# Altium project Buck-Converter-MP2315.PrjPcb
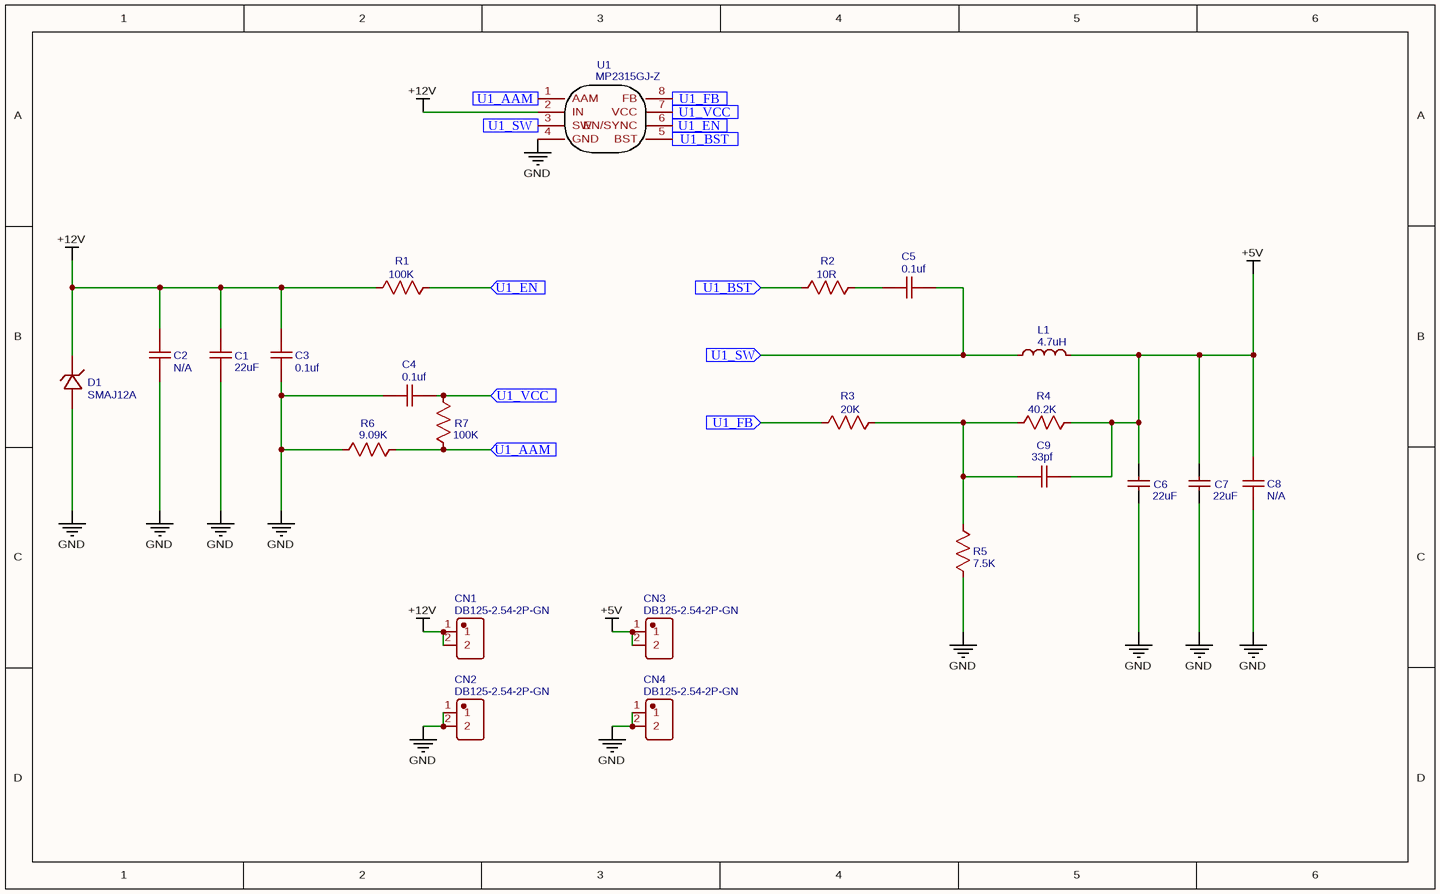
[diagram p0: Buck-Converter-MP2315.schdoc]
1 sheet, 23 parts. Net scope: flat (ports and power ports of the same name join across sheets).
Board file: Buck-Converter-MP2315.pcbdoc

## Sheet Buck-Converter-MP2315.schdoc
size 268 x 166 mm

### Parts
C1  22uF  [C1206]
C2  N/A  [C1206]
C3  0.1uf  [C0603]
C4  0.1uf  [C0603]
C5  0.1uf  [C0603]
C6  22uF  [C0805]
C7  22uF  [C0805]
C8  N/A  [C0805]
C9  33pf  [C0603]
CN1  DB125-2.54-2P-GN  [CONN-TH_DB125-2.54-2P-GN]
CN2  DB125-2.54-2P-GN  [CONN-TH_DB125-2.54-2P-GN]
CN3  DB125-2.54-2P-GN  [CONN-TH_DB125-2.54-2P-GN]
CN4  DB125-2.54-2P-GN  [CONN-TH_DB125-2.54-2P-GN]
D1  SMAJ12A  [SMA_L4.3-W2.6-LS5.1-RD]
L1  4.7uH  [IND-SMD_L7.3-W6.6]
R1  100K  [R0603]
R2  10R  [R0603]
R3  20K  [R0603]
R4  40.2K  [R0603]
R5  7.5K  [R0603]
R6  9.09K  [R0603]
R7  100K  [R0603]
U1  MP2315GJ-Z  [TSOT-23-8_L2.9-W1.6-P0.65-LS2.8-BR]

### Ports
U1_AAM (in), U1_BST (in), U1_EN (in), U1_FB (in), U1_SW (in), U1_VCC (in)

### Nets
+5V: C6.2 C7.2 C8.2 C9.2 CN3.1 CN3.2 L1.2 R4.2
+12V: C1.2 C2.2 C3.2 CN1.1 CN1.2 D1.1 R1.1 U1.2(IN)
GND: C1.1 C2.1 C3.1 C4.1 C6.1 C7.1 C8.1 CN2.1 CN2.2 CN4.1 CN4.2 D1.2 R5.1 R6.1 U1.4(GND)
NetC4_2: C4.2 R7.2 U1.7(VCC) ; port U1_VCC
NetC5_1: C5.1 R2.2
NetC5_2: C5.2 L1.1 U1.3(SW) ; port U1_SW
NetC9_1: C9.1 R3.2 R4.1 R5.2
NetR1_2: R1.2 U1.6(EN/SYNC) ; port U1_EN
NetR2_1: R2.1 U1.5(BST) ; port U1_BST
NetR3_1: R3.1 U1.8(FB) ; port U1_FB
NetR6_2: R6.2 R7.1 U1.1(AAM) ; port U1_AAM

### Library data of the parts
C1 = 22uF: BOM_Manufacturer: TDK; BOM_Manufacturer Part: C3216X5R1V226MTJ00E; nameAlias: Capacitance; Contributor: LCSC; BOM_Supplier: LCSC; BOM_Supplier Part: C342620; BOM_JLCPCB Part Class: Extended Part; spicePre: C; spiceSymbolName: C3216X5R1V226MTJ00E
C2 C8 = N/A: nameAlias: Value(F); Contributor: LCEDA_Lib; spicePre: C
  C2: spiceSymbolName: C_1206_US
  C8: spiceSymbolName: C_0805_US
C3-C5 = 0.1uf: nameAlias: Value(F); Contributor: LCEDA_Lib; spicePre: C; spiceSymbolName: C_0603_US
C6 C7 = 22uF: BOM_Manufacturer: MuRata; BOM_Manufacturer Part: GRM21BR61A226ME51L; nameAlias: Capacitance; BOM_Supplier: LCSC; BOM_Supplier Part: C77074; BOM_JLCPCB Part Class: Extended Part; spicePre: C; spiceSymbolName: GRM21BR61A226ME51L
C9 = 33pf: BOM_Manufacturer Part: CL10C330JB8NNNC; BOM_Manufacturer: SAMSUNG; nameAlias: Value(F); Contributor: LCEDA_Lib; BOM_Supplier Part: C1663; BOM_Supplier: LCSC; spicePre: C; spiceSymbolName: C_0603_US
CN1-CN4 = DB125-2.54-2P-GN: BOM_Manufacturer: DIBO(地博电子); Contributor: LCSC; BOM_Supplier: LCSC; BOM_Supplier Part: C918120; BOM_Manufacturer Part: DB125-2.54-2P-GN; BOM_JLCPCB Part Class: Extended Part; spicePre: U; spiceSymbolName: DB125-2.54-2P-GN
D1 = SMAJ12A: BOM_Manufacturer: Brightking Elec (TAIWAN); BOM_Manufacturer Part: SMAJ70A; Contributor: LCSC; BOM_Supplier: LCSC; BOM_Supplier Part: C309908; BOM_JLCPCB Part Class: Extended Part; spicePre: D; spiceSymbolName: SMAJ70A
L1 = 4.7uH: BOM_Manufacturer: PSA(信昌电陶); BOM_Manufacturer Part: MCS0630-4R7MPY1; nameAlias: Inductance; Contributor: LCSC; BOM_Supplier: LCSC; BOM_Supplier Part: C2937097; spicePre: L; spiceSymbolName: MCS0630-4R7MPY1
R1 R7 = 100K: BOM_Manufacturer Part: RC0603FR-07100KL; BOM_Manufacturer: YAGEO; nameAlias: Value(Ω); Contributor: LCEDA_Lib; BOM_Supplier Part: C14675; BOM_Supplier: LCSC; spicePre: R; spiceSymbolName: R_0603_US
R2 = 10R: BOM_Manufacturer Part: RC0603FR-0710RL; BOM_Manufacturer: YAGEO; nameAlias: Value(Ω); Contributor: LCEDA_Lib; BOM_Supplier Part: C109318; BOM_Supplier: LCSC; spicePre: R; spiceSymbolName: R_0603_US
R3 = 20K: BOM_Manufacturer Part: RC0603FR-0720KL; BOM_Manufacturer: YAGEO(国巨); nameAlias: Value(Ω); Contributor: LCEDA_Lib; BOM_Supplier Part: C105575; BOM_Supplier: LCSC; spicePre: R; spiceSymbolName: R_0603_US
R4 = 40.2K: BOM_Manufacturer Part: RC0603FR-0740K2L; BOM_Manufacturer: YAGEO; nameAlias: Value(Ω); Contributor: LCEDA_Lib; BOM_Supplier Part: C137723; BOM_Supplier: LCSC; spicePre: R; spiceSymbolName: R_0603_US
R5 = 7.5K: BOM_Manufacturer Part: RC0603FR-077K5L; BOM_Manufacturer: YAGEO; nameAlias: Value(Ω); Contributor: LCEDA_Lib; BOM_Supplier Part: C114634; BOM_Supplier: LCSC; spicePre: R; spiceSymbolName: R_0603_US
R6 = 9.09K: BOM_Manufacturer Part: AC0603FR-079K09L; BOM_Manufacturer: YAGEO; nameAlias: Value(Ω); Contributor: LCEDA_Lib; BOM_Supplier Part: C228111; BOM_Supplier: LCSC; spicePre: R; spiceSymbolName: R_0603_US
U1 = MP2315GJ-Z: BOM_Manufacturer: MPS; BOM_Supplier: LCSC; BOM_Manufacturer Part: MP2315GJ-Z; BOM_Supplier Part: C45889; BOM_JLCPCB Part Class: Extended Part; spicePre: U; spiceSymbolName: MP2315GJ-Z